# Altium schematic sheet radar.SchDoc
size A4; SheetNumber: 2; SheetTotal: 3
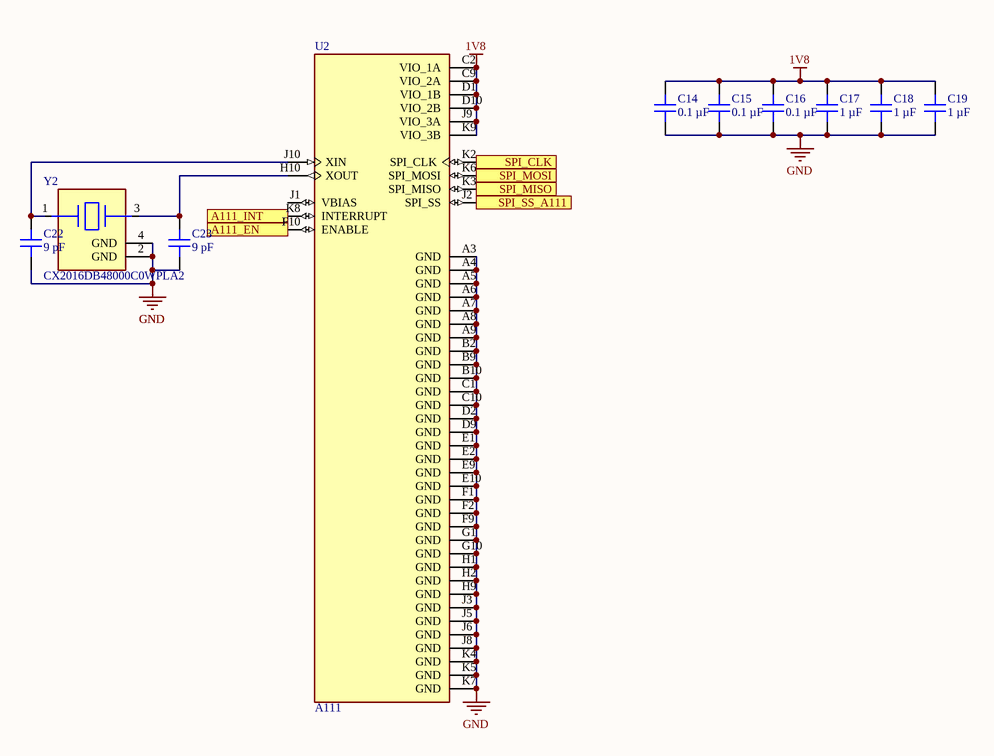
[diagram p0: radar.SchDoc]

## Parts
C14  0.1 µF  [CAP 0402_1005]
C15  0.1 µF  [CAP 0402_1005]
C16  0.1 µF  [CAP 0402_1005]
C17  1 µF  [CAP 0402_1005]
C18  1 µF  [CAP 0402_1005]
C19  1 µF  [CAP 0402_1005]
C22  9 pF  [CAP 0402_1005]
C23  9 pF  [CAP 0402_1005]
U2  A111  [BGA50N50P10X10_520X550X89N]
Y2  CX2016DB48000C0WPLA2  [FP-CX2016DB48000C0WPLA2-MFG]

## Ports
A111_EN, A111_INT, SPI_CLK, SPI_MISO, SPI_MOSI, SPI_SS_A111

## Nets
1V8: C14.2 C15.2 C16.2 C17.2 C18.2 C19.2 U2.C2(VIO_1A) U2.C9(VIO_2A) U2.D1(VIO_1B) U2.D10(VIO_2B) U2.J9(VIO_3A) U2.K9(VIO_3B)
GND: C14.1 C15.1 C16.1 C17.1 C18.1 C19.1 C22.1 C23.1 U2.A3(GND) U2.A4(GND) U2.A5(GND) U2.A6(GND) U2.A7(GND) U2.A8(GND) U2.A9(GND) U2.B2(GND) U2.B9(GND) U2.B10(GND) U2.C1(GND) U2.C10(GND) U2.D2(GND) U2.D9(GND) U2.E1(GND) U2.E2(GND) U2.E9(GND) U2.E10(GND) U2.F1(GND) U2.F2(GND) U2.F9(GND) U2.G1(GND) U2.G10(GND) U2.H1(GND) U2.H2(GND) U2.H9(GND) U2.J3(GND) U2.J5(GND) U2.J6(GND) U2.J8(GND) U2.K4(GND) U2.K5(GND) U2.K7(GND) Y2.2(GND) Y2.4(GND)
A111_EN: U2.F10(ENABLE) ; port A111_EN
A111_INT: U2.K8(INTERRUPT) ; port A111_INT
SPI_CLK: U2.K2(SPI_CLK) ; port SPI_CLK
SPI_MISO: U2.K3(SPI_MISO) ; port SPI_MISO
SPI_MOSI: U2.K6(SPI_MOSI) ; port SPI_MOSI
SPI_SS_A111: U2.J2(SPI_SS) ; port SPI_SS_A111
NetC22_2: C22.2 U2.J10(XIN) Y2.1(1_HOT)
NetC23_2: C23.2 U2.H10(XOUT) Y2.3(2_HOT)

Not connected (* = marked no-connect by the designer): U2 J1(VBIAS)

## Library data of the parts
C14-C16 = C0402C104K7PAC7867: CAP CER 0.1UF 4V X5R 0402; manufacturer: KEMET; Tolerance: ±10%; Part Number: C0402C104K7PAC7867; Value: 0.1 µF; Applications: Bypass, Decoupling; Capacitance: 0.1 µF; componentlink1description: Datasheet; componentlink1url: https://api.kemet.com/component-edge/download/datasheet/C0402C104K7PAC7867.pdf; componentlink2description: DigiKey Link; componentlink2url: https://www.digikey.com/en/products/detail/kemet/C0402C104K7PAC7867/7381987; Device Package: 0402 (1005 Metric); lastupdated: 11/9/2022 9:36:31 am; Lifecycle Status: Active; Minimum Order: 1; Mounting Type: Surface Mount, MLCC; Operating Temperature: -55°C ~ 85°C; Package / Case: 0402 (1005 Metric); packaging: TapeAndReel; partid: 5603; Part Status: Active; price: 0.01; series: SMD Comm X5R; Size / Dimension: 0.039" L x 0.020" W (1.00mm x 0.50mm); Supplier 1: DigiKey; Supplier Part Number 1: 399-14871-1-ND; Temperature Coefficient: X5R; Thickness (Max): 0.022" (0.55mm); Voltage - Rated: 4V
C17-C19 = LMK105C6105KV-F: CAP CER 1UF 10V X6S 0402; manufacturer: Taiyo Yuden; Tolerance: ±10%; Part Number: LMK105C6105KV-F; Value: 1 µF; Applications: SMPS Filtering; Capacitance: 1 µF; componentlink1description: Datasheet; componentlink1url: https://www.yuden.co.jp/productdata/catalog/mlcc01_e.pdf; componentlink2description: DigiKey Link; componentlink2url: https://www.digikey.com/en/products/detail/taiyo-yuden/LMK105C6105KV-F/4157226; Device Package: 0402 (1005 Metric); lastupdated: 11/9/2022 9:36:40 am; Lifecycle Status: Active; Minimum Order: 1; Mounting Type: Surface Mount, MLCC; Operating Temperature: -55°C ~ 105°C; Package / Case: 0402 (1005 Metric); packaging: TapeAndReel; partid: 2215; Part Status: Active; price: 0.01; series: M; Size / Dimension: 0.039" L x 0.020" W (1.00mm x 0.50mm); Supplier 1: DigiKey; Supplier Part Number 1: 587-3409-1-ND; Temperature Coefficient: X6S; Thickness (Max): 0.022" (0.55mm); Voltage - Rated: 10V
C22 C23 = CGA2B2C0G1H090D050BA: CAP CER 9PF 50V C0G 0402; manufacturer: TDK Corporation; Temperature Coefficient: C0G, NP0; Tolerance: ±0.5pF; Part Number: CGA2B2C0G1H090D050BA; Value: 9 pF; Applications: Automotive; Capacitance: 9 pF; componentlink1description: Datasheet; componentlink1url: https://product.tdk.com/info/en/catalog/datasheets/mlcc_automotive_general_en.pdf?ref_disty=digikey; componentlink2description: DigiKey Link; componentlink2url: https://www.digikey.com/en/products/detail/tdk-corporation/CGA2B2C0G1H090D050BA/2443061; Device Package: 0402 (1005 Metric); lastupdated: 14/9/2022 7:45:59 am; Lifecycle Status: Active; Minimum Order: 1; Mounting Type: Surface Mount, MLCC; Operating Temperature: -55°C ~ 125°C; Package / Case: 0402 (1005 Metric); packaging: TapeAndReel; partid: 7122; Part Status: Active; price: 0.01; Ratings: AEC-Q200; series: CGA; Size / Dimension: 0.039" L x 0.020" W (1.00mm x 0.50mm); Supplier 1: DigiKey; Supplier Part Number 1: 445-5583-1-ND; Thickness (Max): 0.022" (0.55mm); Voltage - Rated: 50V
U2 = A111: A111 Radar Sensor; MF: acconeer; SnapEDA_Link: https://www.snapeda.com/parts/A111/acconeer/view-part/2777907/?ref=snap; Price: None; MP: A111; Value: *; Availability: Unavailable; Package: SMD-50 acconeer
Y2 = CMP-20727-000003-1: CRYSTAL 48.0000MHZ 7PF SMD; Manufacturer: Kyocera; Tolerance: 20ppm; Esr: 22Ω; Frequency: 48000kHz; Height: 0.45mm; Load Capacitance: 7pF; Temperature: -40°C to +85°C; Automotive: No; Temperature Range High: +85°C; Octopart: https://octopart.com/cx2016db48000c0wpla2-avx+%2F+kyocera-52876167; Device Class L2: Crystals / Oscillators; Lead Free: Yes; Digikey Description: CRYSTAL 48.0000MHZ 7PF SMD; Mouser Description: Crystals 48MHz 7pF; Device Class L1: Passive Components; RoHS: TRUE; Temperature Range Low: -40°C; Package: 0; ComponentLink2Description: Datasheet; Device Class L3: Crystals; Series: CX2016DB; Category: Crys; ComponentLink2URL: https://global.kyocera.com/prdct/electro/product/pdf/cx2016db_e.pdf; Manufacturer Part Number: CX2016DB48000C0WPLA2